# Altium project REF.PrjPcb (part 2 of 2)

## Sheet REF_Connectors.SchDoc
size A4; SheetNumber: 6; SheetTotal: 8
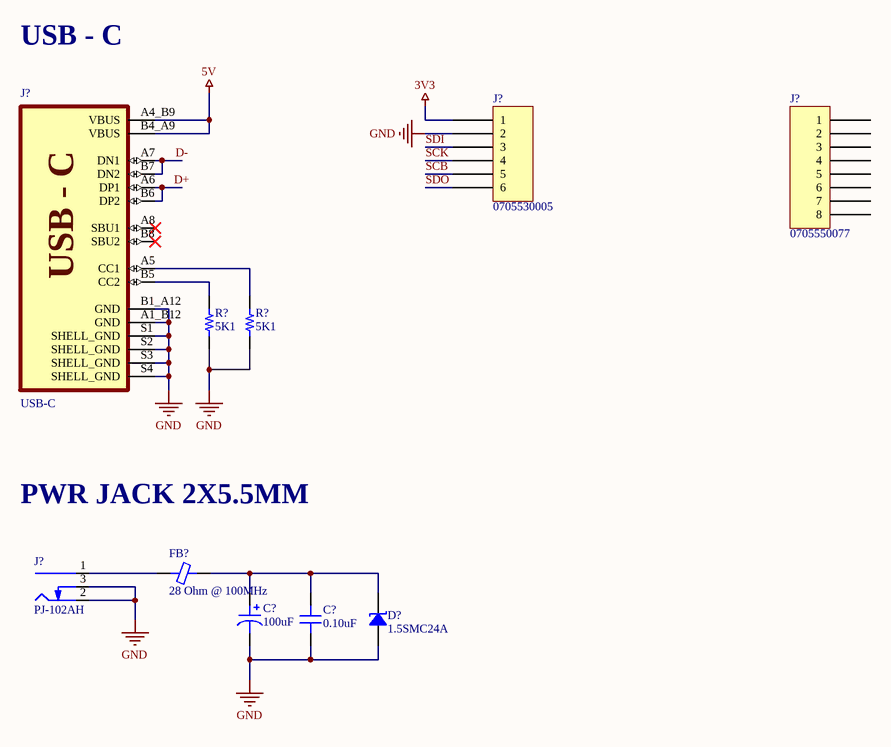
[diagram p5: REF_Connectors.SchDoc]

### Parts
(Parts that share a designator on the sheet are numbered #1, #2 ... from top to bottom, then left to right.)
C?#56  100uF  [CAP ALUM 10.3MM]
C?#57  0.10uF  [CAP 0603/1608]
D?#3  1.5SMC24A  [DO214AB SMC]
FB?#5  28 Ohm @ 100MHz  [FER 0603/1608]
J?#2  0705530005  [MOLEX SDA-70553-6PIN]
J?#3  0705550077  [MOLEX SDA-70555-8PIN]
J?#4  USB-C  [GCT_USB4105-GF-A]
J?#5  PJ-102AH  [CUI PJ-102AH]
R?#19  5K1  [RES 0603/1608]
R?#20  5K1  [RES 0603/1608]

### Nets
3V3: J?#2.1
5V: J?#4.A4_B9(VBUS) J?#4.B4_A9(VBUS)
GND: C?#56.2 C?#57.1 D?#3.1 J?#2.2 J?#4.A1_B12(GND) J?#4.B1_A12(GND) J?#4.S1(SHELL_GND) J?#4.S2(SHELL_GND) J?#4.S3(SHELL_GND) J?#4.S4(SHELL_GND) J?#5.2(Outer) J?#5.3(SW) R?#19.1 R?#20.1
D+: J?#4.A6(DP1) J?#4.B6(DP2)
D-: J?#4.A7(DN1) J?#4.B7(DN2)
SCB: J?#2.5
SCK: J?#2.4
SDI: J?#2.3
SDO: J?#2.6
NetC?#56_1: C?#56.1 C?#57.2 D?#3.2 FB?#5.2
NetFB?#5_1: FB?#5.1 J?#5.1(Centre)
NetJ?#4_A5: J?#4.A5(CC1) R?#20.2
NetJ?#4_B5: J?#4.B5(CC2) R?#19.2

Not connected (* = marked no-connect by the designer): J?#3 1 2 3 4 5 6 7 8; J?#4 A8(SBU1)* B8(SBU2)*

### Notes on the sheet
- USB - C
- PWR JACK 2X5.5MM
- (in symbol USB4105-GF-A) USB - C

### Library data of the parts
C?#56 = EEE-1HA101P: CAP ALUM 100UF 20% 50V SMD; Manufacturer: Panasonic Electronic Components; TemperatureRange: -40C ~ 85C; Type: Automotive; Ripple Current: 250mA; Lifetime @ Temp: 2000 Hrs @ 85C; Value: 100uF; Part Number: EEE-1HA101P; PartId: 7398; Supplier 1: Digi-Key; Supplier Part Number 1: PCE3916TR-ND; ComponentLink1Description: Datasheet; ComponentLink1URL: http://media.digikey.com/pdf/Data%20Sheets/Panasonic%20Electronic%20Components/S_Series_Type_V.pdf; ComponentLink2Description: Digi-Key listing; ComponentLink2URL: http://digikey.com/product-detail/en/EEE-1HA101P/PCE3916TR-ND/766083; Tolerance: 20%; Voltage: 50V; Price: 0.3144; Device Package: Radial, Can - SMD; Impedance: -
C?#57 = C0603C104J3RACTU: CAP CER 0.1UF 25V X7R 0603; Manufacturer: Kemet; TemperatureRange: -55C ~ 125C; Tolerance: 5%; Value: 0.10uF; Part Number: C0603C104J3RACTU; PartId: 13224; Supplier 1: Digi-Key; Supplier Part Number 1: 399-1282-2-ND; ComponentLink1Description: Datasheet; ComponentLink1URL: http://www.kemet.com/docfinder?Partnumber=C0603C104J3RACTU; ComponentLink2Description: Digi-Key Listing; ComponentLink2URL: https://www.digikey.com/product-detail/en/kemet/C0603C104J3RACTU/399-1282-2-ND/416045; TemperatureCoefficient: X7R; Voltage: 25V; Price: 0.0714; Device Package: 0603 (1608 Metric)
D?#3 = 1.5SMC24A: TVS DIODE 20.5V 33.2V DO214AB; Manufacturer: Littelfuse Inc.; Current - Peak Pulse (10/1000µs): 45.8A; Power Line Protection: No; Power - Peak Pulse: 1500W (1.5kW); Type: Zener; Unidirectional Channels: 1; Voltage - Breakdown (Min): 22.8V; Part Number: 1.5SMC24A; Applications: General Purpose; ComponentLink1Description: Datasheet; ComponentLink1URL: https://www.littelfuse.com/~/media/electronics/datasheets/tvs_diodes/littelfuse_tvs_diode_1_5smc_datasheet.pdf.pdf; ComponentLink2Description: DigiKey Link; ComponentLink2URL: http://digikey.com/product-detail/en/littelfuse-inc/1.5SMC24A/1.5SMC24ACT-ND/1835386; LastUpdated: 9/2/2020 1:20:00 AM; Lifecycle Status: Active; Minimum Order: 1; Mounting Type: Surface Mount; Operating Temperature: -55°C ~ 150°C (TJ); Package / Case: DO-214AB, SMC; Packaging: TapeAndReel; PartId: 6399; Part Status: Active; Price: 0.18; Series: 1.5SMC; Supplier 1: DigiKey; Supplier Part Number 1: 1.5SMC24ACT-ND; Supplier Device Package: DO-214AB (SMCJ); Voltage - Clamping (Max) @ Ipp: 33.2V; Voltage - Reverse Standoff (Typ): 20.5V
FB?#5 = 742792603: FERRITE CHIP 28 OHM 4.0A 0603; Manufacturer: Wurth Electronics Inc; Type: Differential Mode - Single; DC Resistance: 30 mOhm Max; Current Rating: 4A; Part Number: 742792603; PartId: 6745; Value: 28 Ohm @ 100MHz; Supplier 1: Digi-Key; Supplier Part Number 1: 732-1590-2-ND; ComponentLink1Description: Datasheet; ComponentLink1URL: http://katalog.we-online.de/pbs/datasheet/742792603.pdf; ComponentLink2Description: Digi-Key listing; ComponentLink2URL: http://digikey.com/product-detail/en/742792603/732-1590-2-ND/1638994; Price: 0.1829; Device Package: 0603 (1608 Metric)
J?#2 = 0705530005: CONN HEADER R/A 6POS 2.54MM; Manufacturer: Molex; Contact Length - Mating: 0.240" (6.10mm); Contact Length - Post: 0.130" (3.30mm); Material Flammability Rating: UL94 V-0; Number of Positions: 6; Number of Positions Loaded: All; Pitch - Mating: 0.100" (2.54mm); Shrouding: Shrouded - 4 Wall; Style: Board to Cable/Wire; Voltage Rating: 250V; Part Number: 0705530005; ComponentLink1Description: Datasheet; ComponentLink1URL: https://www.molex.com/pdm_docs/sd/705530005_sd.pdf; ComponentLink2Description: DigiKey Link; ComponentLink2URL: http://digikey.com/product-detail/en/molex/0705530005/WM4904-ND/114967; Connector Type: Header; Contact Finish - Mating: Gold; Contact Finish - Post: Tin; Contact Finish Thickness - Mating: 15.0µin (0.38µm); Contact Material: Phosphor Bronze; Contact Shape: Square; Contact Type: Male Pin; Fastening Type: Latch Holder; Insulation Color: Black; Insulation Height: 0.215" (5.45mm); Insulation Material: Polyester, Glass Filled; LastUpdated: 1/12/2020 11:56:47 PM; Lifecycle Status: Active; Minimum Order: 1; Mounting Type: Through Hole, Right Angle; Number of Rows: 1; Operating Temperature: -40°C ~ 105°C; Packaging: Tube; PartId: 89; Part Status: Active; Price: 1.80; Series: SL 70553; Supplier 1: DigiKey; Supplier Part Number 1: WM4904-ND; Termination: Solder
J?#3 = 0705550077: CONN HEADER R/A 8POS 2.54MM; Manufacturer: Molex; Contact Length - Mating: 0.240" (6.10mm); Contact Length - Post: 0.130" (3.30mm); Material Flammability Rating: UL94 V-0; Number of Positions: 8; Number of Positions Loaded: All; Pitch - Mating: 0.100" (2.54mm); Shrouding: Shrouded - 4 Wall; Style: Board to Cable/Wire; Voltage Rating: 250V; Part Number: 0705550077; ComponentLink1Description: Datasheet; ComponentLink1URL: https://www.molex.com/pdm_docs/ps/PS-70400.pdf; ComponentLink2Description: DigiKey Link; ComponentLink2URL: http://digikey.com/product-detail/en/molex/0705550077/WM14789-ND/3302495; Connector Type: Header; Contact Finish - Mating: Gold; Contact Finish - Post: Tin; Contact Finish Thickness - Mating: 30.0µin (0.76µm); Contact Material: Phosphor Bronze; Contact Shape: Square; Contact Type: Male Pin; Fastening Type: Latch Holder; Features: Board Guide; Insulation Color: Black; Insulation Height: 0.215" (5.45mm); Insulation Material: Polyester, Glass Filled; LastUpdated: 1/13/2020 12:05:25 AM; Lifecycle Status: Active; Minimum Order: 1; Mounting Type: Through Hole, Right Angle; Number of Rows: 1; Operating Temperature: -40°C ~ 105°C; Packaging: Tube; PartId: 107; Part Status: Active; Price: 3.18; Series: SL 70555; Supplier 1: DigiKey; Supplier Part Number 1: WM14789-ND; Termination: Solder
J?#4 = USB4105-GF-A: USB-C (USB TYPE-C) USB 2.0 Receptacle Connector 24 (16+8 Dummy) Position Surface Mount, Right Angle; Through Hole; Value: *; Availability: Unavailable; Price: None; Package: None; MP: USB4105-GF-A
J?#5 = PJ-102AH: CONN PWR JACK 2X5.5MM SOLDER; Manufacturer: CUI Devices; Actual Diameter: 0.079" (2.00mm ID), 0.256" (6.50mm OD); Current Rating (Amps): 5A; Gender: Male; Industry Recognized Mating Diameter: 2.00mm ID (0.079"), 5.50mm OD (0.217"); Internal Switch(s): Single Switch, Normally Closed; Material Flammability Rating: UL94 V-0; Mating Length/Depth: 0.354" (9.00mm); Number of Positions/Contacts: 2 Conductors, 3 Contacts; Shielding: Unshielded; Voltage - Rated: 24VDC; Part Number: PJ-102AH; ComponentLink1Description: Datasheet; ComponentLink1URL: https://www.cuidevices.com/product/resource/digikeypdf/pj-102ah.pdf; ComponentLink2Description: DigiKey Link; ComponentLink2URL: //digikey.com/product-detail/en/cui-devices/PJ-102AH/CP-102AH-ND/408448; Connector Type: Jack; LastUpdated: 12/16/2019 7:01:27 PM; Lifecycle Status: 0; Minimum Order: 1; Mounting Type: Through Hole, Right Angle; Packaging: Tray; Part Status: Active; Price: 0.76; Series: -; Supplier 1: DigiKey; Supplier Part Number 1: CP-102AH-ND; Termination: Solder
R?#19 R?#20 = 0603S8J0512: RES SMD 5K1 OHM 5% 1/8W 0603; Manufacturer: Uniohm; TemperatureRange: -55C ~ 155C; TemperatureCoefficient: 100ppm/C; PowerRating: 0.125W, 1/8W; Value: 5K1; Part Number: 0603S8J0512; Tolerance: 5%; Price: 0.0089; Device Package: 1608 (0603 Metric)

## Sheet REF_Diverse.SchDoc
size A4; SheetNumber: 7; SheetTotal: 8
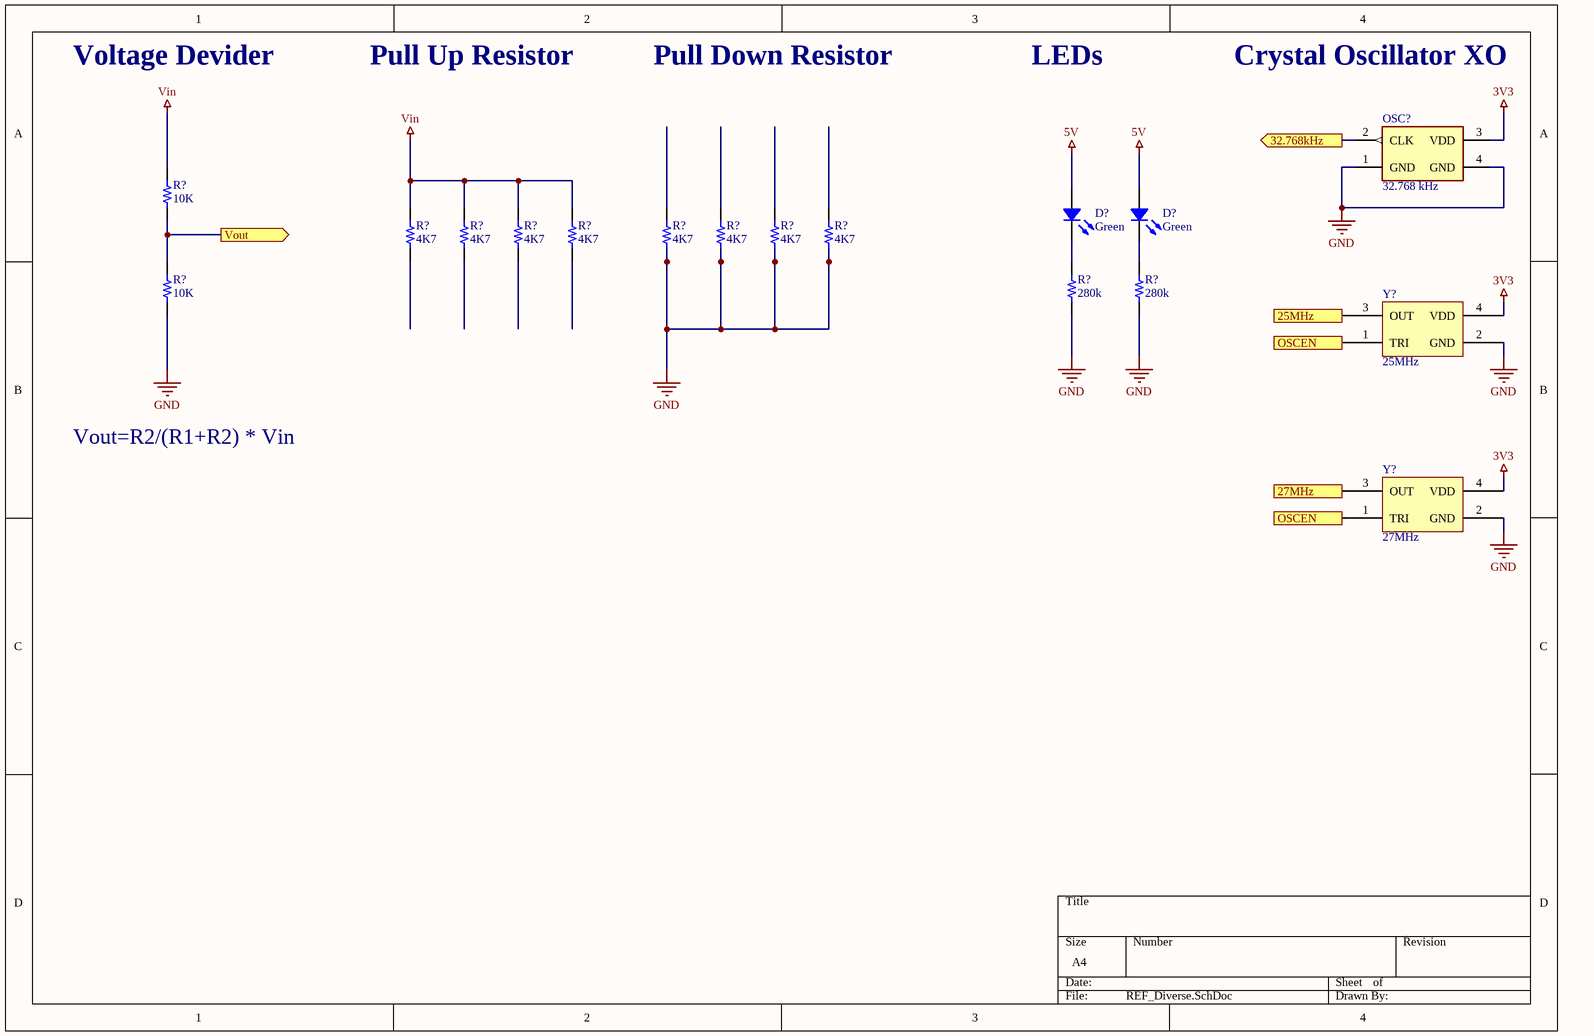
[diagram p6: REF_Diverse.SchDoc]

### Parts
(Parts that share a designator on the sheet are numbered #1, #2 ... from top to bottom, then left to right.)
D?#4  Green  [LED 0603/1608 GREEN]
D?#5  Green  [LED 0603/1608 GREEN]
OSC?  32.768 kHz  [SiT1532AIJ4DCC32768E - duplicate]
R?#21  10K  [RES 0603/1608]
R?#22  4K7  [RES 0603/1608]
R?#23  4K7  [RES 0603/1608]
R?#24  4K7  [RES 0603/1608]
R?#25  4K7  [RES 0603/1608]
R?#26  4K7  [RES 0603/1608]
R?#27  4K7  [RES 0603/1608]
R?#28  4K7  [RES 0603/1608]
R?#29  4K7  [RES 0603/1608]
R?#30  10K  [RES 0603/1608]
R?#31  280k  [RES 1206/3216]
R?#32  280k  [RES 1206/3216]
Y?#5  25MHz  [ABRACON ASD]
Y?#6  27MHz  [ABRACON ASD]

### Ports
25MHz (out), 27MHz (out), 32.768kHz (out), OSCEN (in), Vout (out)

### Nets
3V3: OSC?.3(VDD) Y?#5.4(VDD) Y?#6.4(VDD)
5V: D?#4.1 D?#5.1
GND: OSC?.1(GND) OSC?.4(GND) R?#26.1 R?#27.1 R?#28.1 R?#29.1 R?#30.1 R?#31.2 R?#32.2 Y?#5.2(GND) Y?#6.2(GND)
Vin: R?#21.2 R?#22.2 R?#23.2 R?#24.2 R?#25.2
NetD?#4_2: D?#4.2 R?#31.1
NetD?#5_2: D?#5.2 R?#32.1
NetIC?#4_C2: OSC?.2(CLK) ; port 32.768kHz
NetIC?#5_J1: Y?#5.1(TRI) Y?#6.1(TRI) ; port OSCEN
NetIC?#5_J2: Y?#6.3(OUT) ; port 27MHz
NetR?#21_1: R?#21.1 R?#30.2 ; port Vout
NetY?#5_3: Y?#5.3(OUT) ; port 25MHz

Not connected (* = marked no-connect by the designer): R?#22 1; R?#23 1; R?#24 1; R?#25 1; R?#26 2; R?#27 2; R?#28 2; R?#29 2

### Notes on the sheet
- Voltage Devider
- Pull Up Resistor
- Pull Down Resistor
- LEDs
- Crystal Oscillator XO
- Vout=R2/(R1+R2) * Vin

### Library data of the parts
D?#4 D?#5 = HSMQ-C191: LED GREEN DIFFUSED 0603 SMD; Manufacturer: Avago Technologies US Inc.; Type: Surface Mount; Millicandela: 145mcd; Voltage Forward: 3.4V; Current (Test): 20mA; Viewing Angle: 140; Value: Green; Part Number: HSMQ-C191; PartId: 7059; Supplier 1: Digi-Key; Supplier Part Number 1: 516-1807-2-ND; ComponentLink1Description: Datasheet; ComponentLink1URL: http://www.avagotech.com/docs/AV02-0977EN; ComponentLink2Description: Digi-Key Listing; ComponentLink2URL: http://www.digikey.ca/product-detail/en/HSMQ-C191/516-1807-2-ND/1012398; Price: 0.4769; Device Package: 0603 (1608 Metric); Colour: Green; Lens Transparency: Diffused
OSC? = SiT1532AI: Oscilator 32.768KHz, SiT1532AI-J4-DCC-32.768E
R?#21 R?#30 = 0603S8J0103: RES SMD 10K OHM 5% 1/8W 0603; Manufacturer: Uniohm; TemperatureRange: -55C ~ 155C; TemperatureCoefficient: 100ppm/C; PowerRating: 0.125W, 1/8W; Value: 10K; Part Number: 0603S8J0103; Tolerance: 5%; Price: 0.0089; Device Package: 1608 (0603 Metric)
R?#22-R?#29 = 0603S8J0472: RES SMD 4K7 OHM 5% 1/8W 0603; Manufacturer: Uniohm; TemperatureRange: -55C ~ 155C; TemperatureCoefficient: 100ppm/C; PowerRating: 0.125W, 1/8W; Value: 4K7; Part Number: 0603S8J0472; Tolerance: 5%; Price: 0.0089; Device Package: 1608 (0603 Metric)
R?#31 R?#32 = ERA-8AEB2803V: RES SMD 280K OHM 0.1% 1/4W 1206; Manufacturer: Panasonic Electronic Components; TemperatureRange: -55C ~ 155C; TemperatureCoefficient: 25ppm/C; PowerRating: 0.25W, 1/4W; Value: 280k; Part Number: ERA-8AEB2803V; PartId: 3611; Supplier 1: Digi-Key; Supplier Part Number 1: P280KBCTR-ND; ComponentLink1Description: Datasheet; ComponentLink1URL: http://industrial.panasonic.com/lecs/www-data/pdf/AOA0000/AOA0000CE26.pdf; ComponentLink2Description: Digi-Key listing; ComponentLink2URL: http://digikey.com/product-detail/en/ERA-8AEB2803V/P280KBCTR-ND/3070936; Tolerance: 0.1%; Price: 0.1954; Type: Thin Film; Device Package: 1206 (3216 Metric)
Y?#5 = ASD1-25.000MHZ-EC-T: OSC XO 25.000MHZ CMOS SMD; Manufacturer: Abracon LLC; Frequency Stability: 50ppm; Part Number: ASD1-25.000MHZ-EC-T; PartId: 8941; Supplier 1: Digi-Key; Supplier Part Number 1: 535-9593-2-ND; ComponentLink1Description: Datasheet; ComponentLink1URL: http://www.abracon.com/Oscillators/ASDseries.pdf; ComponentLink2Description: Digi-Key Listing; ComponentLink2URL: https://www.digikey.com/product-detail/en/ASD1-25.000MHZ-EC-T/535-9593-2-ND/1236910; Price: 1.74; Type: XO (Standard); Device Package: 4-SMD, No Lead (DFN, LCC); Series: ASD; Frequency: 25MHz
Y?#6 = ASD1-27.000MHZ-EC-T: OSC XO 27.000MHZ CMOS SMD; Manufacturer: Abracon LLC; Frequency Stability: 50ppm; Part Number: ASD1-27.000MHZ-EC-T; PartId: 8938; Supplier 1: Digi-Key; Supplier Part Number 1: 535-9594-2-ND; ComponentLink1Description: Datasheet; ComponentLink1URL: http://www.abracon.com/Oscillators/ASDseries.pdf; ComponentLink2Description: Digi-Key Listing; ComponentLink2URL: https://www.digikey.com/product-detail/en/ASD1-27.000MHZ-EC-T/535-9594-2-ND/1236911; Price: 1.74; Type: XO (Standard); Device Package: 4-SMD, No Lead (DFN, LCC); Series: ASD; Frequency: 27MHz

## Sheet REF_Sensors.SchDoc
size A4; SheetNumber: 8; SheetTotal: 8
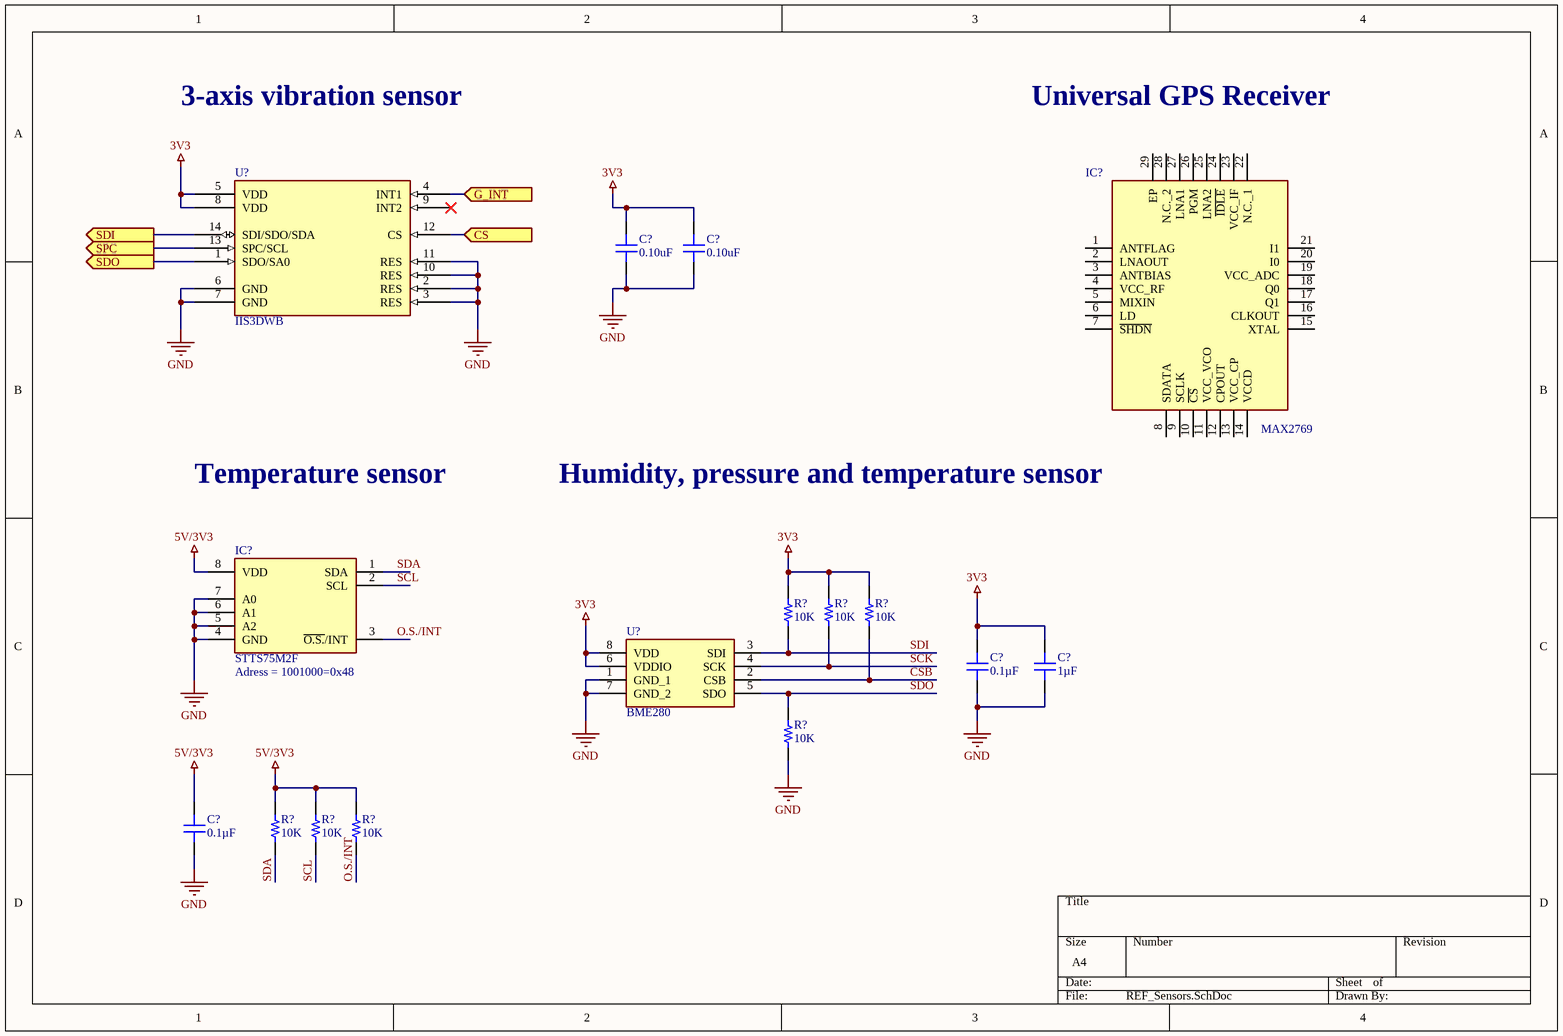
[diagram p7: REF_Sensors.SchDoc]

### Parts
(Parts that share a designator on the sheet are numbered #1, #2 ... from top to bottom, then left to right.)
C?#58  0.10uF  [CAP 0603/1608]
C?#59  0.10uF  [CAP 0603/1608]
C?#60  0.1µF  [CAP 0603_1608]
C?#61  1µF  [CAP 0603_1608]
C?#62  0.1µF  [CAP 0603_1608]
IC?#7  MAX2769  [QFN50P500X500X80-29N]
IC?#8  STTS75M2F  [SOIC127P600X175-8N]
R?#33  10K  [RES 0603/1608]
R?#34  10K  [RES 0603/1608]
R?#35  10K  [RES 0603/1608]
R?#36  10K  [RES 0603/1608]
R?#37  10K  [RES 0603/1608]
R?#38  10K  [RES 0603/1608]
R?#39  10K  [RES 0603/1608]
U?#3  IIS3DWB  [PQFN50P250X300X86-14N]
U?#4  BME280  [BME280]

### Ports
CS (in), G_INT (in), SDI (out), SDO (out), SPC (out)

### Nets
3V3: C?#58.2 C?#59.2 C?#60.1 C?#61.2 R?#33.2 R?#34.2 R?#35.2 U?#3.5(VDD) U?#3.8(VDD) U?#4.6(VDDIO) U?#4.8(VDD)
5V/3V3: C?#62.2 IC?#8.8(VDD) R?#37.2 R?#38.2 R?#39.2
GND: C?#58.1 C?#59.1 C?#60.2 C?#61.1 C?#62.1 IC?#8.4(GND) IC?#8.5(A2) IC?#8.6(A1) IC?#8.7(A0) R?#36.1 U?#3.2(RES) U?#3.3(RES) U?#3.6(GND) U?#3.7(GND) U?#3.10(RES) U?#3.11(RES) U?#4.1(GND_1) U?#4.7(GND_2)
CSB: R?#35.1 U?#4.2(CSB)
O.S./INT: IC?#8.3(~{O.S.}/INT) R?#39.1
SCK: R?#34.1 U?#4.4(SCK)
SCL: IC?#8.2(SCL) R?#38.1
SDA: IC?#8.1(SDA) R?#37.1
SDI: R?#33.1 U?#4.3(SDI)
SDO: R?#36.2 U?#4.5(SDO)
NetU?#3_1: U?#3.1(SDO/SA0) ; port SDO
NetU?#3_4: U?#3.4(INT1) ; port G_INT
NetU?#3_12: U?#3.12(CS) ; port CS
NetU?#3_13: U?#3.13(SPC/SCL) ; port SPC
NetU?#3_14: U?#3.14(SDI/SDO/SDA) ; port SDI

Not connected (* = marked no-connect by the designer): IC?#7 1(ANTFLAG) 2(LNAOUT) 3(ANTBIAS) 4(VCC_RF) 5(MIXIN) 6(LD) 7(~{SHDN}) 8(SDATA) 9(SCLK) 10(~{CS}) 11(VCC_VCO) 12(CPOUT) 13(VCC_CP) 14(VCCD) 15(XTAL) 16(CLKOUT) 17(Q1) 18(Q0) 19(VCC_ADC) 20(I0) 21(I1) 22(N.C._1) 23(VCC_IF) 24(~{IDLE}) 25(LNA2) 26(PGM) 27(LNA1) 28(N.C._2) 29(EP); U?#3 9(INT2)*

### Notes on the sheet
- 3-axis vibration sensor
- Universal GPS Receiver
- Temperature sensor
- (near IC?#7) Humidity, pressure and temperature sensor
- (near IC?#8) Adress = 1001000=0x48

### Library data of the parts
C?#58 C?#59 = CL10B104KA8NNNC: CAP CER 0.1UF 25V X7R 0603; Manufacturer: Samsung Electro-Mechanics America, Inc.; TemperatureRange: -55C ~ 125C; Tolerance: 10%; Value: 0.10uF; Part Number: CL10B104KA8NNNC; PartId: 13014; Supplier 1: Digi-Key; Supplier Part Number 1: 1276-1006-2-ND; ComponentLink1Description: Datasheet; ComponentLink1URL: http://www.samsungsem.com/kr/support/product-search/mlcc/CL10B104KA8NNNC.jsp; ComponentLink2Description: Digi-Key Listing; ComponentLink2URL: https://www.digikey.com/product-detail/en/samsung-electro-mechanics-america-inc/CL10B104KA8NNNC/1276-1006-2-ND/3886664; TemperatureCoefficient: X7R; Voltage: 25V; Price: 0.0035; Device Package: 0603 (1608 Metric)
C?#60 C?#62 = 06033C104JAT2A: CAP CER 0.1UF 25V X7R 0603; Manufacturer: AVX Corporation; Tolerance: ±5%; Part Number: 06033C104JAT2A; Value: 0.1µF; Applications: General Purpose; Capacitance: 0.1µF; ComponentLink1Description: Datasheet; ComponentLink1URL: http://datasheets.avx.com/X7RDielectric.pdf; ComponentLink2Description: DigiKey Link; ComponentLink2URL: http://digikey.com/product-detail/en/avx-corporation/06033C104JAT2A/478-3713-1-ND/1116411; Device Package: 0603 (1608 Metric); LastUpdated: 9/2/2020 1:03:17 AM; Lifecycle Status: Active; Minimum Order: 1; Mounting Type: Surface Mount, MLCC; Operating Temperature: -55°C ~ 125°C; Package / Case: 0603 (1608 Metric); Packaging: TapeAndReel; PartId: 12698; Part Status: Active; Price: 0.07; Series: -; Size / Dimension: 0.063" L x 0.032" W (1.60mm x 0.81mm); Supplier 1: DigiKey; Supplier Part Number 1: 478-3713-1-ND; Temperature Coefficient: X7R; Thickness (Max): 0.035" (0.90mm); Voltage - Rated: 25V
C?#61 = 06033C105KAT2A: CAP CER 1UF 25V X7R 0603; Manufacturer: AVX Corporation; Tolerance: ±10%; Part Number: 06033C105KAT2A; Value: 1µF; Applications: General Purpose; Capacitance: 1µF; ComponentLink1Description: Datasheet; ComponentLink1URL: http://datasheets.avx.com/X7RDielectric.pdf; ComponentLink2Description: DigiKey Link; ComponentLink2URL: http://digikey.com/product-detail/en/avx-corporation/06033C105KAT2A/478-10046-1-ND/6564269; Device Package: 0603 (1608 Metric); LastUpdated: 9/2/2020 1:03:32 AM; Lifecycle Status: Active; Minimum Order: 1; Mounting Type: Surface Mount, MLCC; Operating Temperature: -55°C ~ 125°C; Package / Case: 0603 (1608 Metric); Packaging: TapeAndReel; PartId: 4115; Part Status: Active; Price: 0.07; Series: -; Size / Dimension: 0.063" L x 0.032" W (1.60mm x 0.81mm); Supplier 1: DigiKey; Supplier Part Number 1: 478-10046-1-ND; Temperature Coefficient: X7R; Thickness (Max): 0.037" (0.94mm); Voltage - Rated: 25V
IC?#7 = MAX2769BETI_V+: IC Unverseal GPS Receiver; Manufacturer_Name: Maxim Integrated; Manufacturer_Part_Number: MAX2769BETI/V+; Datasheet Link: https://pdfserv.maximintegrated.com/en/ds/MAX2769B.pdf; Height: 0.8mm; Mouser Part Number: 700-MAX2769BETI/V+; Mouser Price/Stock: https://www.mouser.com/Search/Refine.aspx?Keyword=700-MAX2769BETI%2FV%2B
IC?#8 = STTS75M2F: IC Temperature sensor; Manufacturer_Name: STMicroelectronics; Datasheet Link: http://www.st.com/st-web-ui/static/active/en/resource/technical/document/datasheet/CD00153513.pdf; Height: 1.75mm; Manufacturer_Part_Number: STTS75M2F; Mouser Part Number: 511-STTS75M2F; Mouser Price/Stock: https://www.mouser.com/Search/Refine.aspx?Keyword=511-STTS75M2F; Arrow Part Number: STTS75M2F; Arrow Price/Stock: https://www.arrow.com/en/products/stts75m2f/stmicroelectronics
R?#33-R?#39 = 0603S8J0103: as R?#21 on sheet REF_Diverse; Value: 10K; Part Number: 0603S8J0103; Tolerance: 5%; Price: 0.0089; Device Package: 1608 (0603 Metric)
U?#3 = IIS3DWB: 3-axis digital vibration sensor
U?#4 = BME280: MEMS humidity, pressure and temperature sensor

## Nets that join several sheets
3V3: REF_Power (7 pins), REF_CPU_STM32_A (14 pins), REF_CPU_STM32_B1 (44 pins), REF_CPU_STM32_B2 (R?#17.1 Y?#3.3 Y?#4.4), REF_Connectors (J?#2.1), REF_Diverse (OSC?.3 Y?#5.4 Y?#6.4), REF_Sensors (11 pins)
5V: REF_LCD (6 pins), REF_Power (8 pins), REF_Connectors (J?#4.A4_B9 J?#4.B4_A9), REF_Diverse (D?#4.1 D?#5.1)
GND: REF_LCD (11 pins), REF_Power (18 pins), REF_CPU_STM32_A (15 pins), REF_CPU_STM32_B1 (80 pins), REF_CPU_STM32_B2 (5 pins), REF_Connectors (14 pins), REF_Diverse (11 pins), REF_Sensors (18 pins)
NetC?#10_1: REF_CPU_STM32_A (5 pins), REF_CPU_STM32_B2 (C?#55.2 IC?#5.K1)
NetIC?#4_C2: REF_CPU_STM32_B2 (IC?#4.C2 Y?#3.2), REF_Diverse (OSC?.2)
NetIC?#5_J1: REF_CPU_STM32_B2 (IC?#5.J1 Y?#4.1), REF_Diverse (Y?#5.1 Y?#6.1)
NetIC?#5_J2: REF_CPU_STM32_B2 (IC?#5.J2 Y?#4.3), REF_Diverse (Y?#6.3)